# EAGLE design Adafruit QT 5-3V Shifter (EAGLE 9.6.2)
COMPANY: ADAFRUIT INDUSTRIES; DRAWN: KTOWN; REV: A
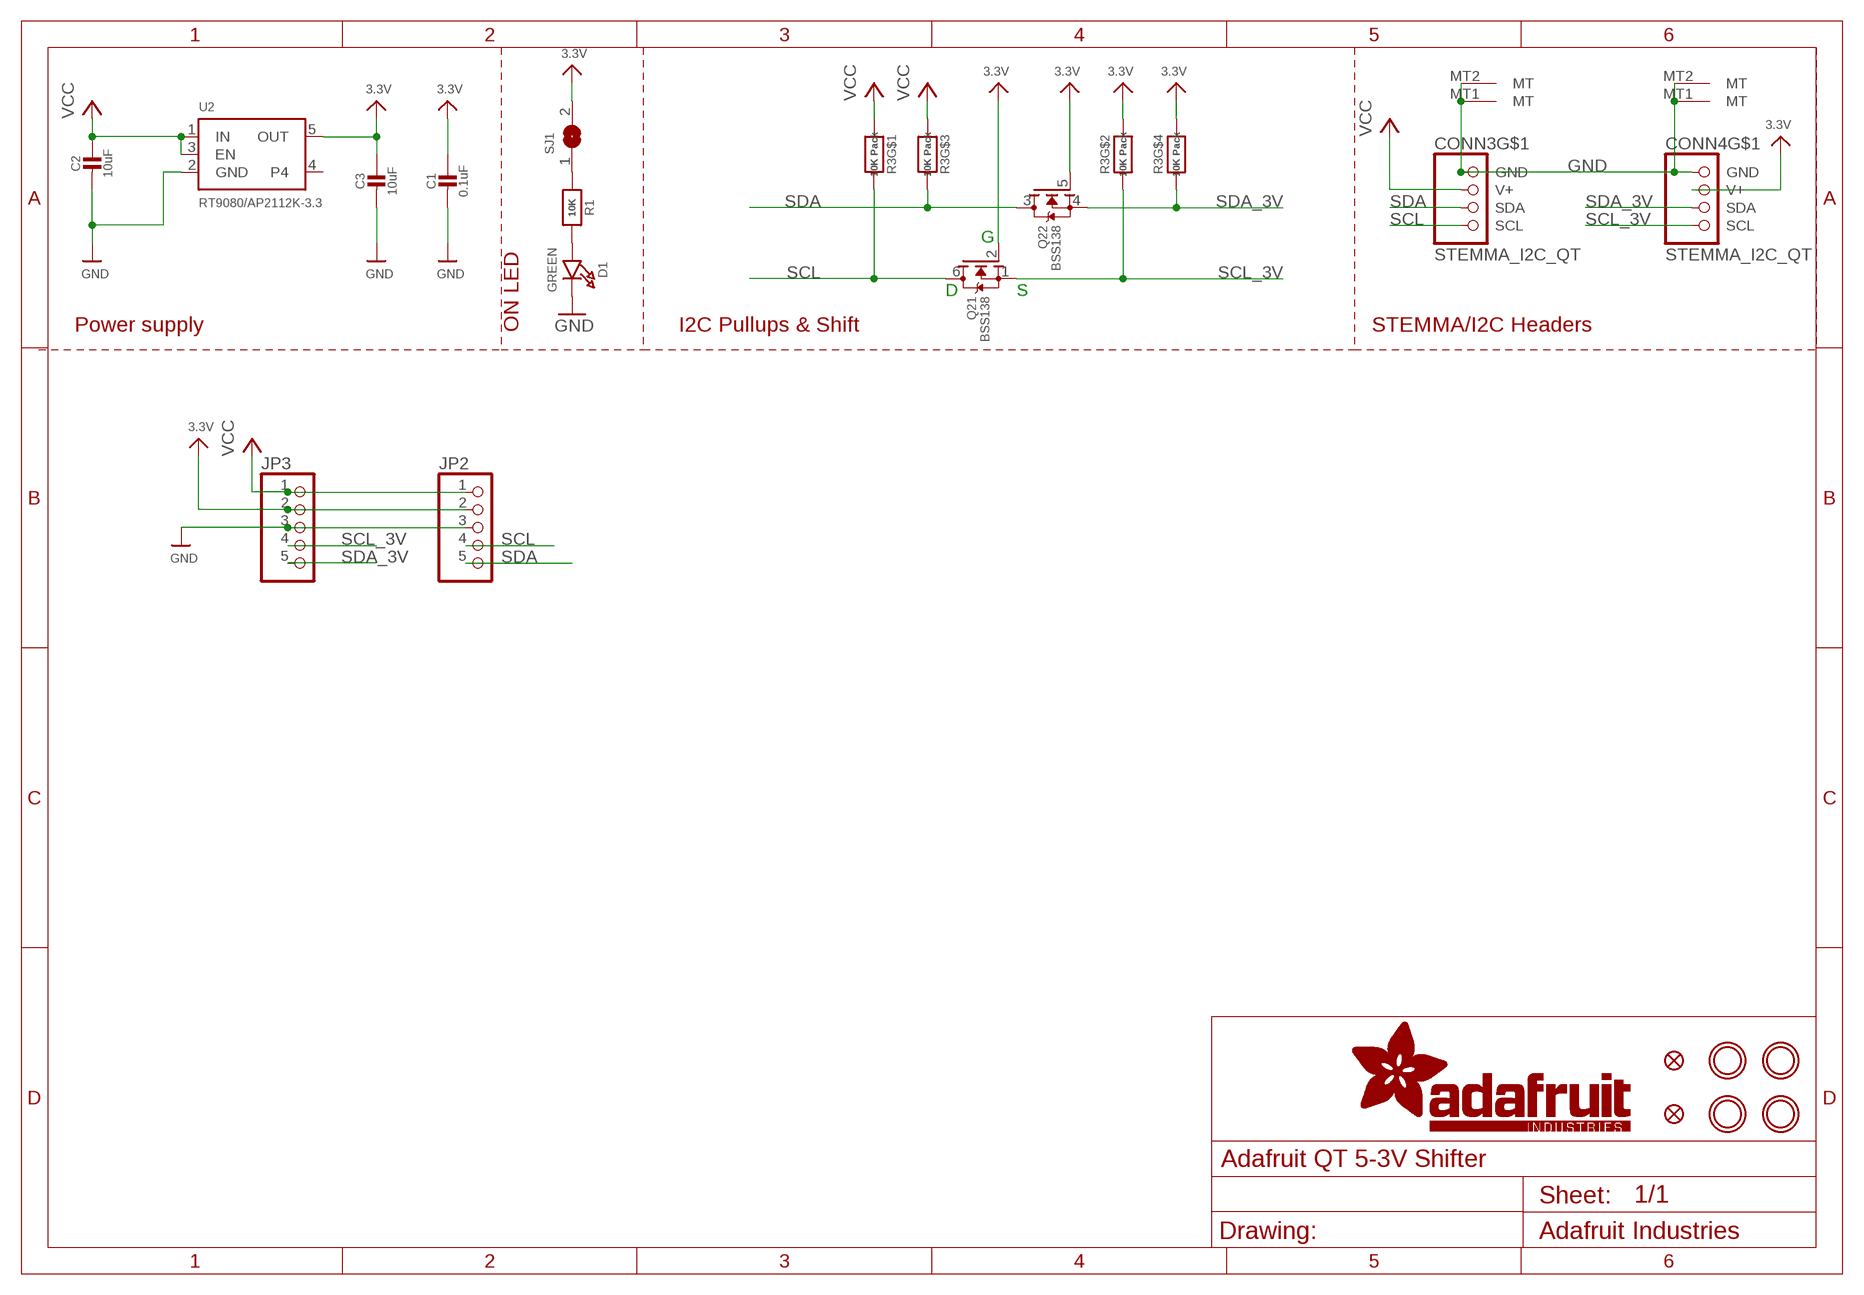
[diagram p0: schematic, sheet 1]

## Parts
C1  0.1uF  CAP_CERAMIC0603_NO  [0603-NO]
C2  10uF  CAP_CERAMIC0805-NOOUTLINE  [0805-NO]
C3  10uF  CAP_CERAMIC0805-NOOUTLINE  [0805-NO]
CONN3  STEMMA_I2C_QT  [JST_SH4]
CONN4  STEMMA_I2C_QT  [JST_SH4]
D1  GREEN  LED0603_NOOUTLINE  [CHIPLED_0603_NOOUTLINE]
FID3  FIDUCIAL_1MM  [FIDUCIAL_1MM]
FID4  FIDUCIAL_1MM  [FIDUCIAL_1MM]
JP2  HEADER-1X576MIL  [1X05_ROUND_76]
JP3  HEADER-1X576MIL  [1X05_ROUND_76]
Q2  BSS138  MOSFET-N_DUAL  [SOT363]
R1  10K  RESISTOR_0603_NOOUT  [0603-NO]
R3  10K Pack  RESISTOR_4PACK  [RESPACK_4X0603]
SJ1  SOLDERJUMPERCLOSED  [SOLDERJUMPER_CLOSEDWIRE]
U2  RT9080/AP2112K-3.3  VREG_SOT23-5  [SOT23-5]
U$1  MOUNTINGHOLE2.5  [MOUNTINGHOLE_2.5_PLATED]
U$17  MOUNTINGHOLE2.5  [MOUNTINGHOLE_2.5_PLATED]
U$19  MOUNTINGHOLE2.5  [MOUNTINGHOLE_2.5_PLATED]
U$21  MOUNTINGHOLE2.5  [MOUNTINGHOLE_2.5_PLATED]

## Nets
3.3V [lowpower]: C1.1 C3.1 CONN4.2(V+) JP2.2 JP3.2 Q2.2(1:G) Q2.5(2:G) R3.2 R3.4 SJ1.2 U2.5(OUT)
GND [highpower]: C1.2 C2.2 C3.2 CONN3.1(GND) CONN3.MT1(MT) CONN3.MT2(MT) CONN4.1(GND) CONN4.MT1(MT) CONN4.MT2(MT) D1.C JP2.3 JP3.3 U2.2(GND)
N$1: D1.A R1.2
N$2 [lowpower]: R1.1 SJ1.1
SCL: CONN3.4(SCL) JP2.4 Q2.6(1:D) R3.8
SCL_3V: CONN4.4(SCL) JP3.4 Q2.1(1:S) R3.7
SDA: CONN3.3(SDA) JP2.5 Q2.3(2:D) R3.6
SDA_3V: CONN4.3(SDA) JP3.5 Q2.4(2:S) R3.5
VCC [highpower]: C2.1 CONN3.2(V+) JP2.1 JP3.1 R3.1 R3.3 U2.1(IN) U2.3(EN)
Unconnected: U2.4

## Notes on the sheet
- G
- D | S
- Power supply | ON LED | I2C Pullups & Shift | STEMMA/I2C Headers

## Library data of the parts
C1-C3 = microbuilder:CAP_CERAMIC: Ceramic Capacitors For new designs, use the packages preceded by an '_' character since they are more reliable: The following footprints should be used on most boards: _0402 - Standard footprint for regular board layouts _0603 - Standard footprint for regular board layouts _0805 - Standard footprint for regular board layouts _1206 - Standard footprint for regular board layouts For extremely tight-pitch boards where space is at a premium, the following 'micro-pitch' footprints can be used (smaller pads, no silkscreen outline, etc.): _0402MP - Micro-pitch footprint for very dense/compact boards _0603MP - Micro-pitch footprint for very dense/compact boards _0805MP - Micro-pitch footprint for very dense/compact boards _1206MP - Micro-pitch footprint for very dense/compact boards
CONN3 CONN4 = adafruit_electromech:STEMMA_I2C; LCSC: C2845363
D1 = microbuilder:LED: LED 0603 - 0603 Surface Mount Package 2mA: Green LED - Low Power (3.9mcd, 2ma, 1.7Vf) - Digikey: 475-2709-2-ND Orange LED - Low Power (9.8mcd, 2ma, 1.8Vf) - Digikey: 475-1194-2-ND Red LED - Low Power (5mcd, 2ma, 1.8Vf) - Digikey: 475-1195-2-ND Yellow LED - Low Power (7mcd, 2ma, 1.8Vf) - Digikey: 475-1196-2-ND 5mA: Blue LED - Low Power (17mcd, 5ma, 2.9Vf) - Digikey: LNJ937W8CRACT-ND 0805 - 0805 Surface Mount Package 2mA: Red LED (8.8mcd, 2mA, 1.8Vf, Clear) - Low Power [Digikey: 475-2510-1-ND] Green LED (5mcd, 2mA, 1.8Vf, Clear) - Low Power [Digikey: 475-2730-1-ND] Yellow LED (11.3mcd, 2mA, 1.8Vf, Clear) - Low Power [Digikey: 475-2555-1-ND] 20mA: Red LED (104mcd, 20mA, Diffused) - LS R976 [Digikey: 475-1278-6-ND] Red LED (12mcd, 20mA, 2.0Vf, Clear) - APT2012EC [Digikey: 754-1128-1-ND] Green LED (15mcd, 20mA, 2.2Vf, Clear) - APT2012GC [Digikey: 754-1131-1-ND] Orange LED (160mcd, 20mA, 2.1Vf, Clear) - APT2012SECK [Digikey: 754-1130-1-ND] 1206 - 1206 Surface Mount Package Green LED (26mcd, 20mA, Diffused) - LG N971 [Digikey: 475-1407-6-ND] Red LED (15mcd, 20mA, Diffused) - LH N974 [Digikey: 475-1416-6-ND] Cree - Cree High-Power Surface Mount LEDs XPEBWT-L1-0000-00D50 - White 111lm 350mA 2.9Vf 6200K 110° XTEAWT-00-0000-00000LEE3 - White 114lm 350mA 2.85Vf 5000K 115° Everlight - Everlight 45-21 Series Surface Mount LEDs 45-21/QK2C-B2832AC2CB2/2T - Warm White 2000mcd 20mA 3.25Vf 3050K 120° 45-21/LK2C-B38452C4CB2/2T - Nuetral White 2000mcd 20mA 3.25Vf 4150K 120° 45-21/LK2C-B50634C6CB2/2T - Cold White 2200mcd 20mA 3.25Vf 5650K 120° PLCC2 Reverse Mount LS T77K-J1L2-1-0-2-R18-Z - Red 11.25mcd 2mA 1.8Vf 630nm 120° LO T77K-L1M2-24-Z - Orange 19.6mcd 2mA 1.8Vf 606nm 120° LY T77K-K2M1-26-Z - Yellow 15.7mcd 2mA 1.8Vf 587nm 120°; ROT: 270
FID3 FID4 = microbuilder:FIDUCIAL: Fiducial Alignment Points Various fiducial points for machine vision alignment.; BOM: EXCLUDE
JP2 JP3 = microbuilder:HEADER-1X5: PIN HEADER
Q2 = microbuilder:MOSFET-N_DUAL: Dual N-Channel MOSFET SOT363 (2.0x1.25mm) 2N7002PS - 60V, 320mA [Digikey: 568-5984-1-ND]; JLC_ROTATION: 270
R1 = microbuilder:RESISTOR: Resistors For new designs, use the packages preceded by an '_' character since they are more reliable: The following footprints should be used on most boards: _0402 - Standard footprint for regular board layouts _0603 - Standard footprint for regular board layouts _0805 - Standard footprint for regular board layouts _1206 - Standard footprint for regular board layouts For extremely tight-pitch boards where space is at a premium, the following 'micro-pitch' footprints can be used (smaller pads, no silkscreen outline, etc.): _0402MP - Micro-pitch footprint for very dense/compact boards _0603MP - Micro-pitch footprint for very dense/compact boards _0805MP - Micro-pitch footprint for very dense/compact boards _1206MP - Micro-pitch footprint for very dense/compact boards
R3 = microbuilder:RESISTOR_4PACK: Resistor Packs (4 resistors) 4 x 0603 10K 1/16W - Digikey: YC164J-10KCT-ND
SJ1 = microbuilder:SOLDERJUMPER: SMD Solder JUMPER Solder the two pads together to create a connection, or remove the solder to break it. REFLOW - Use this footprint for solder paste and reflow ovens. WAVE - Use this footprint for hand-soldering (larger pads). CLOSED - Has a trace between the two pads to ensure it is closed by default. The trace needs to be cut to disable the jumper, and can be closed again by creating a solder bridge between the two pads.
U2 = adafruit_power:VREG_SOT23-5: SOT23-5 Fixed Voltage Regulators Part Current Out V Out V In V Dropout θJA (°C/W) TJ (°C) Digikey Part No. ADP121 150mA 3.3V 3.4-5.5V 0.09V @ 150mA -- -- ADP121-AUJZ33R7CT-ND ADP121 150mA 3.0V 3.1-5.5V 0.09V @ 150mA -- -- ADP121-AUJZ30R7CT-ND ADP122 300mA 3.3V 3.4-5.5V 0.085V @ 300mA -- -- ADP122AUJZ-3.3-R7CT-ND ADP1712 300mA 3.3V 3.5-5.5V 0.17V @ 300mA -- -- ADP1712AUJZ-3.3-R7TR-ND AP7311 (Low Cost) 150mA 3.3V 3.5-6V 0.15V @ 150mA -- -- AP7311-33WG-7DICT-ND LD39015M18R 150mA 1.8V 1.9V-5.5V 0.08V @ 100mA -- -- 497-6977-1-ND LP2985A-33DBVR 150mA 3.3V 3.3-16V 0.28V @ 150mA 206 150 296-18479-1-ND MCP1824T-3302E/OT 300mA 3.3V 3.5V-6V 0.2V @ 300mA -- -- MCP1824T-3302E/OTCT-ND MIC5205-2.5YM5 TR 150mA 2.5V 2.7-16V 0.165V @ 150mA -- -- 576-1257-2-ND MIC5205-3.0YM5 TR 150mA 3.0V 3.2V-16V 0.165V @ 150mA -- -- 576-1258-2-ND MIC5205-3.3YM5 TR 150mA 3.3V 3.5V-16V 0.165V @ 150mA -- -- 576-1259-2-ND TPS780330220 150mA 3.3V+2.2V 3.6-5.5V 250mV Max -- -- 296-23332-1-ND TDA3663/N1,135 100mA 3.3V 3.5-45V 0.18V @ 50mA -- -- 568-5343-1-ND Max operating temp can be calculated using θJA, TJ (max junction temperature), and power in watts. Set the "Maximum Ambient Temperature" until it reaches TJ ("Max Junction Temperature"), which is the absolute limit for safe use of the regulator: Heat Sink Temperature Calculator <http://www.daycounter.com/Calculators/Heat-Sink-Temperature-Calculator.phtml> For example, With 12V source into a 3.3V LP2985 and a 30mA load, we are dissipating (12V-3.3V) * 0.03A = 0.261W. With a θJA of 206 °C/W, a TJ of 150°C, and 261mW we can safely use the chip without a heat sink up to 75°C (=147.1°C Junction Temperature).; JLC_ROTATION: 0
U$1 U$17 U$19 U$21 = adafruit_electromech:MOUNTINGHOLE: Mounting Hole For #2 screws (0.086"/2.18mm width, 0.094"/2.4mm hole) use 2.5mm; BOM: EXCLUDE

## Net classes
1 highpower: width 0.305 mm, drill 0.483 mm
2 lowpower: width 0.254 mm, drill 0.483 mm

## Board
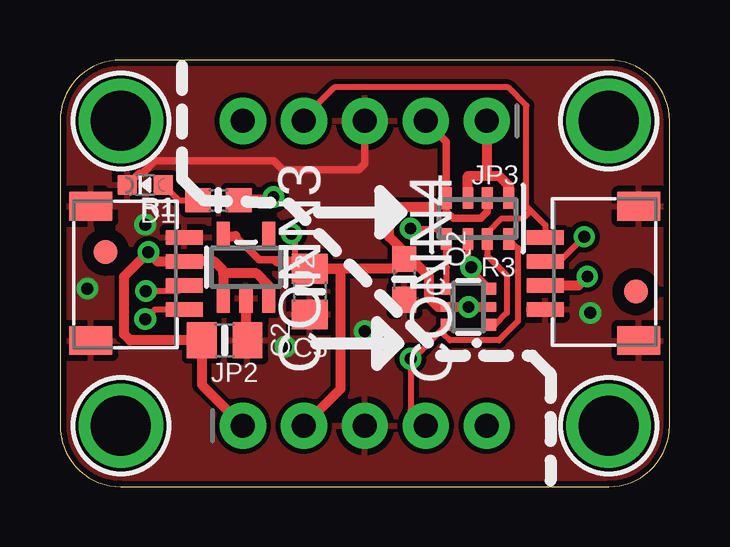
[diagram p1: board, top side]
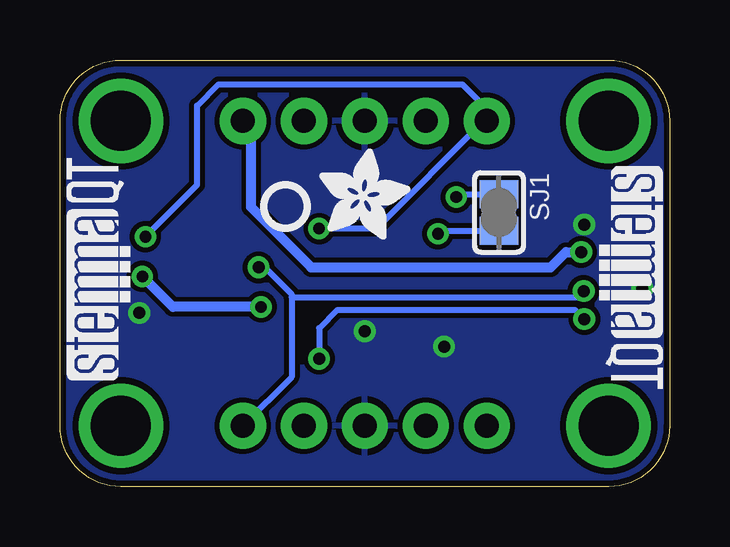
[diagram p2: board, bottom side, seen from below]

Size 25.4 x 17.78 mm. Coordinates in mm from the lower left corner, seen from the top.
Outline: 0,15.24 0,2.54 arc90 2.54,0 22.86,0 arc90 25.4,2.54 25.4,15.24 arc90 22.86,17.78 2.54,17.78 arc90 0,15.24
Copper layers (1*16): Top 0.035mm / dielectric 1.5mm / Bottom 0.035mm
Design rules "adafruit *": minimum track width 8mil, minimum drill 15.5mil, track to track 8mil, track to pad 8mil, pad to pad 8mil, via to via 8mil, smd to smd 8mil, copper to edge 10mil, drill to drill 8mil, minimum pad ring 10mil, minimum via ring 8mil, stop-mask expansion 2mil, vias tented up to drill 20mil, thermal gap 10mil

### Footprints (pad centres in the part's own frame; a part is rotated, then mirrored left to right if it is on the bottom)
0603-NO = smd 1.075 x 1: 1 -0.85,0; 2 0.85,0
0805-NO = smd 1.24 x 1.5: 1 -0.95,0; 2 0.95,0
JST_SH4 = smd 0.6 x 1.55: 1 -1.5,2.006; 2 -0.5,2.006; 3 0.5,2.006; 4 1.5,2.006 | smd 1.2 x 1.8: MT1 -2.8,-1.894; MT2 2.8,-1.894
CHIPLED_0603_NOOUTLINE = smd 0.8 x 0.8: A 0,-0.75; C 0,0.75
FIDUCIAL_1MM = smd 1 x 1: 1 0,0
1X05_ROUND_76 = drill 1 pad 1.93: 1 -5.08,0; 2 -2.54,0; 3 0,0; 4 2.54,0; 5 5.08,0
SOT363 = smd 0.5 x 0.5: 1 -0.75,-0.9; 3 0.75,-0.9; 4 0.75,0.9; 6 -0.75,0.9 | smd 0.4 x 0.5: 2 0,-0.9; 5 0,0.9
RESPACK_4X0603 = smd 0.45 x 0.9: 1 -1.3,-0.85; 2 -0.4,-0.85; 3 0.4,-0.85; 4 1.3,-0.85; 5 1.3,0.85; 6 0.4,0.85; 7 -0.4,0.85; 8 -1.3,0.85
SOLDERJUMPER_CLOSEDWIRE = smd 1.168 x 1.6: 1 -0.762,0; 2 0.762,0 | smd 0.635 x 0.203: WIRE 0,0
SOT23-5 = smd 0.55 x 1.2: 1 -0.95,-1.3; 2 0,-1.3; 3 0.95,-1.3; 4 0.95,1.3; 5 -0.95,1.3
MOUNTINGHOLE_2.5_PLATED = drill 2.5 pad 3.2: P$1 0,0

### Placement (x,y rotation side)
C1  14.35,8.64 270 top
C2  6.86,6.1 0 top
C3  10.41,8.13 270 top
CONN3  3.17,8.89 270 top
CONN4  22.23,8.89 90 top
D1  3.56,12.57 90 top
FID3  24,8.13 0 top
FID4  1.91,9.78 0 top
JP2  12.7,2.54 0 top
JP3  12.7,15.24 180 top
PLABEL0  [PLABEL0]  7.11,0.89 0 top
PLABEL1  [PLABEL1]  10.16,0.89 0 top
PLABEL2  [PLABEL2]  12.83,0.89 0 top
PLABEL3  [PLABEL3]  15.62,0.89 0 top
PLABEL4  [PLABEL4]  18.67,0.89 0 top
PLABEL5  [PLABEL5]  0.25,12.45 0 top
PLABEL6  [PLABEL6]  18.16,17.02 180 top
PLABEL7  [PLABEL7]  15.24,17.02 180 top
PLABEL8  [PLABEL8]  12.57,17.02 180 top
PLABEL9  [PLABEL9]  10.03,17.02 180 top
PLABEL10  [PLABEL10]  6.99,17.02 180 top
PLABEL11  [PLABEL11]  12.7,4.45 0 top
PLABEL12  [PLABEL12]  12.7,13.34 180 top
PLABEL13  [PLABEL13]  5.21,11.43 90 bottom
PLABEL14  [PLABEL14]  12.7,6.86 0 bottom
Q2  17.02,7.49 90 top
R1  6.6,11.94 180 top
R3  17.4,11.18 180 top
SJ1  7.11,11.43 270 bottom
U2  7.75,9.14 0 top
U$1  2.54,15.24 0 top
U$2  [ADAFRUIT_3.5MM]  14.61,10.29 0 bottom
U$17  22.86,15.24 0 top
U$19  2.54,2.54 0 top
U$21  22.86,2.54 0 top
U$25  [PCBFEAT-REV-040]  16,11.68 0 bottom
U$30  [STEMMAQT]  22.48,4.45 90 bottom
U$31  [STEMMAQT]  2.92,13.34 270 bottom

### Tracks (layer width: path | path; a pad name or v marks a point on that pad's centre or on a via)
3.3V  (via drill 0.48)
  Top 0.254: v9.65,10.54 9.78,10.41 9.78,9.4
  Top 0.305: R3.2 17.8,11.45 17.53,11.18 16.38,11.18 16.1,11.46 R3.4 16.1,14.38 JP3.2 | 7.3,10.44 8.3,9.45 8.93,9.45 8.98,9.4 9.02,9.4
  Top 0.406: Q2.2 v17.02,7.49 Q2.5 15.75,7.49 15.37,7.87 15.37,8.76 14.22,9.91 | R3.4 15.72,11.64 13.72,11.64 13.72,10.41 14.22,9.91 | CONN4.2 21.6,8.39 v21.97,8.76 | JP2.2 11.68,4.06 11.68,9.08 C3.1 | 14.22,9.91 14.22,9.61 C1.1 13.94,9.08 C3.1 | U2.5 7.3,10.44 | 9.02,9.4 9.78,9.4 10.09,9.4 C3.1
  Bottom 0.254: v9.65,10.54 9.53,10.67 SJ1.2
  Bottom 0.406: v17.02,7.49 20.7,7.49 v21.97,8.76
GND  (via drill 0.5)
  Top 0.305: D1.C 3.31,13.07 3.44,13.07 3.95,13.58 8.9,13.58 9.27,13.21 12.45,13.21 12.7,13.46 JP3.3
  Top 0.406: U2.2 7.75,6.16 C2.2
  other vias: 3.56,10.92 22.1,7.24 1.14,8.26 12.7,6.48 9.4,5.84
  pour Top: 0,17.78 25.4,17.78 25.4,0 0,0
  pour Bottom: 0,17.78 25.4,17.78 25.4,0 0,0
N$1
  Top 0.254: D1.A 4.94,11.94 R1.2
N$2  (via drill 0.48)
  Top 0.254: R1.1 7.58,12.06 v8.89,12.06
  Bottom 0.254: v8.89,12.06 8.76,12.19 SJ1.1
SCL  (via drill 0.5)
  Top 0.254: R3.8 19.08,9.95 19.08,6.89 18.29,6.1 16.26,6.1 15.99,6.36 15.99,6.62 Q2.6 14.71,5.33 v14.61,5.33 14.61,3.17 JP2.4 | v3.56,6.99 3.96,7.39 CONN3.4
  Bottom 0.254: v14.61,5.33 14.61,6.6 13.84,7.37 3.94,7.37 v3.56,6.99
SCL_3V
  Top 0.254: Q2.1 18.13,6.74 18.62,7.24 18.62,8.81 17.8,9.63 R3.7 17.8,10.57 18.41,11.18 19.3,11.18 19.62,11.49 | JP3.4 10.16,15.37 11.43,16.64 18.67,16.64 19.43,15.88 19.43,11.68 19.62,11.49 | 19.62,11.49 20.22,10.9 CONN4.4
SDA  (via drill 0.5)
  Top 0.254: R3.6 17,9.44 17.13,9.31 v17.13,9.14 17.13,9.04 Q2.3 | CONN3.3 4.94,8.15 v3.58,8.15
  Bottom 0.254: v17.13,9.14 16.87,9.14 15.75,8.02 15.75,7.9 | v3.58,8.15 3.83,7.9 15.75,7.9 | 15.75,7.9 15.75,4.57 JP2.5
SDA_3V  (via drill 0.48)
  Top 0.254: Q2.4 16.12,9.13 16.1,9.15 R3.5 15.67,10.76 v14.61,10.76 | CONN4.3 20.82,9.39 v21.84,10.41
  Bottom 0.254: v14.61,10.76 12.23,10.76 7.75,15.24 JP3.5 7.62,15.75 8.64,16.76 18.8,16.76 19.68,15.88 19.68,12.57 v21.84,10.41
VCC  (via drill 0.5)
  Top 0.406: R3.3 17,12.95 17.78,12.95 | 17.78,12.95 18.29,12.95 18.7,12.54 R3.1 | U2.3 8.7,8.38 8.19,8.89 6.8,8.89 | JP2.1 5.91,4.25 C2.1 2.92,6.1 2.67,6.35 2.67,8.76 v3.68,9.78 4.07,9.39 CONN3.2 6.42,9.39 6.8,9.02 6.8,8.89 | 6.8,8.89 U2.1 | JP3.1 17.78,12.95
  Bottom 0.406: v3.68,9.78 4.32,9.78 4.95,9.14 14.94,9.14 17.44,11.64 17.44,14.9 JP3.1

### Text on the board
Pinguin_tBackup: 3DA | 3CL | G | 3V | VIN | 3V logic level | on | 5V logic level | 5V | 3V | G | 5CL | 5DL
Pinguin_bBackup: LED | Stemma QT/Breadboard / 3V LDO+ Level Shifter / 3-5V in, 3V@500mA Out